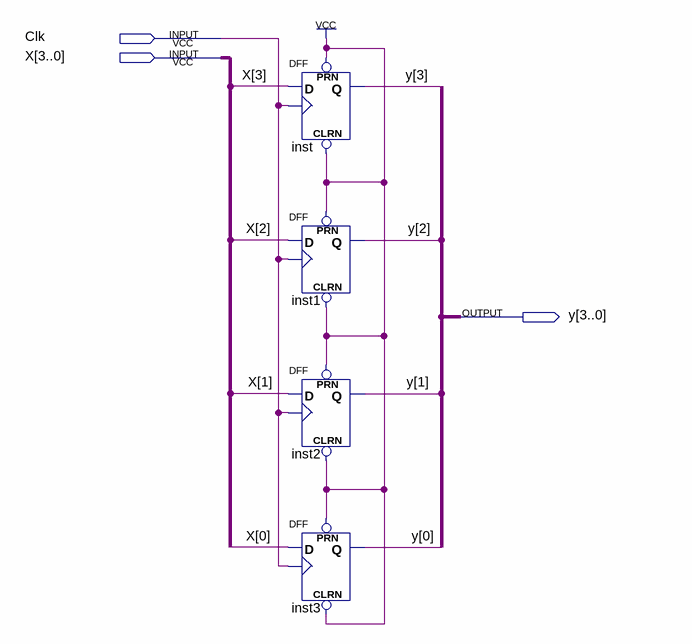
[diagram p0: schematic sheet]
// Quartus schematic 4_D-Flip Flops.bdf as structural Verilog: 4 symbols, 3 pins
module \4_D-Flip_Flops  (
  input  Clk,
  input  [3:0] X,
  output [3:0] y
);

  DFF inst (.CLRN(1'b1), .CLK(Clk), .D(X[3]), .PRN(1'b1), .Q(y[3]));
  DFF inst1 (.CLRN(1'b1), .CLK(Clk), .D(X[2]), .PRN(1'b1), .Q(y[2]));
  DFF inst2 (.CLRN(1'b1), .CLK(Clk), .D(X[1]), .PRN(1'b1), .Q(y[1]));
  DFF inst3 (.CLRN(1'b1), .CLK(Clk), .D(X[0]), .PRN(1'b1), .Q(y[0]));
endmodule
